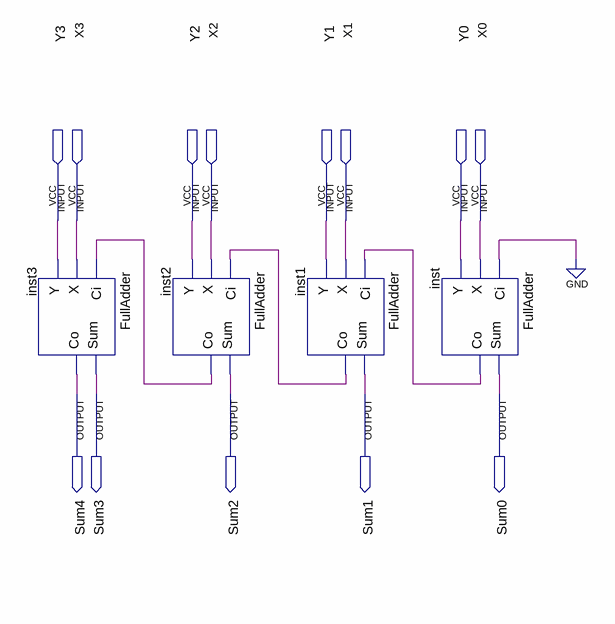
[diagram p0: schematic sheet]
// Quartus schematic Adder.bdf as structural Verilog: 4 symbols, 13 pins
module Adder (
  input  Y3,
  input  X3,
  input  Y2,
  input  X2,
  input  Y1,
  input  X1,
  input  Y0,
  input  X0,
  output Sum4,
  output Sum3,
  output Sum2,
  output Sum1,
  output Sum0
);

  wire inst1_co, inst2_co, inst_co;

  FullAdder inst3 (.X(X3), .Y(Y3), .Ci(inst2_co), .Sum(Sum3), .Co(Sum4));
  FullAdder inst2 (.X(X2), .Y(Y2), .Ci(inst1_co), .Sum(Sum2), .Co(inst2_co));
  FullAdder inst1 (.X(X1), .Y(Y1), .Ci(inst_co), .Sum(Sum1), .Co(inst1_co));
  FullAdder inst (.X(X0), .Y(Y0), .Ci(1'b0), .Sum(Sum0), .Co(inst_co));
endmodule
